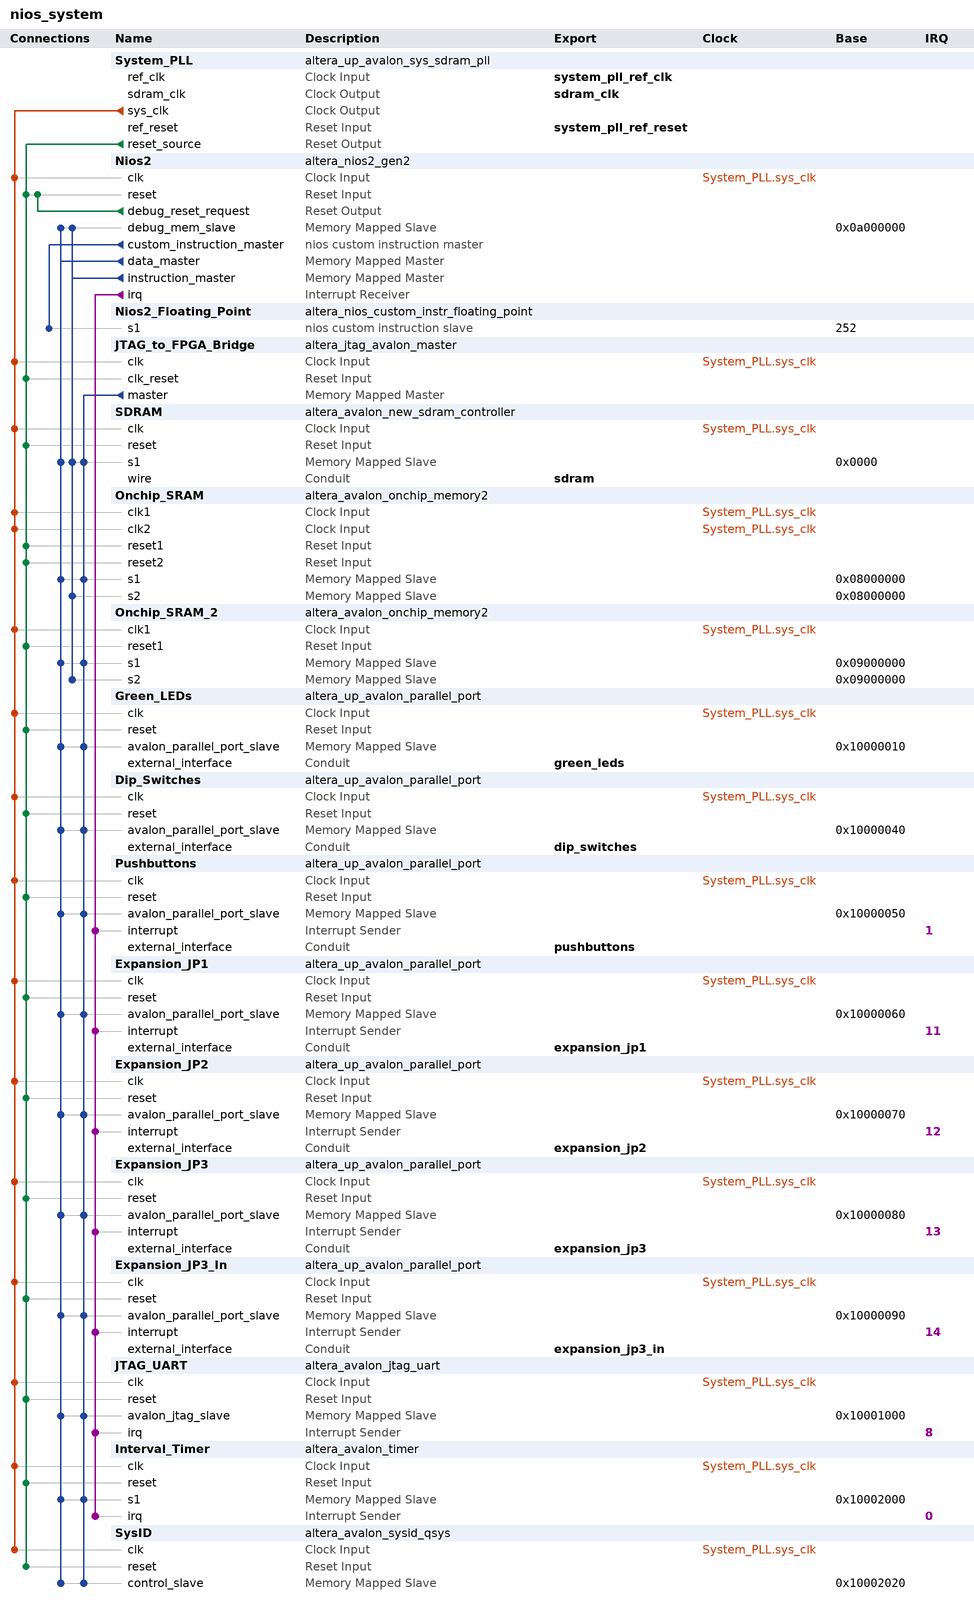
[diagram p0: system contents]
# Platform Designer (Qsys) system nios_system, Cyclone IV E EP4CE22F17C6
# Parameters at their usual value, and those the tool derives, are not listed.
package require -exact qsys 14.1
create_system nios_system
set_project_property DEVICE_FAMILY {Cyclone IV E}
set_project_property DEVICE EP4CE22F17C6

add_instance System_PLL altera_up_avalon_sys_sdram_pll 14.0
set_instance_parameter_value System_PLL CIV_boards DE0-Nano
set_instance_parameter_value System_PLL CV_boards DE1-SoC
set_instance_parameter_value System_PLL gui_outclk 50.0
set_instance_parameter_value System_PLL gui_refclk 50.0

add_instance Nios2 altera_nios2_gen2 14.1
set_instance_parameter_value Nios2 dcache_size 2048
set_instance_parameter_value Nios2 exceptionSlave Onchip_SRAM.s2
set_instance_parameter_value Nios2 icache_size 4096
set_instance_parameter_value Nios2 impl Tiny
set_instance_parameter_value Nios2 resetSlave Onchip_SRAM.s2
set_instance_parameter_value Nios2 resetrequest_enabled false
set_instance_parameter_value Nios2 setting_activateTrace true

add_instance Nios2_Floating_Point altera_nios_custom_instr_floating_point 14.1

add_instance JTAG_to_FPGA_Bridge altera_jtag_avalon_master 14.1

add_instance SDRAM altera_avalon_new_sdram_controller 14.1
set_instance_parameter_value SDRAM TAC 5.5
set_instance_parameter_value SDRAM TRCD 20.0
set_instance_parameter_value SDRAM TRP 20.0
set_instance_parameter_value SDRAM casLatency 3
set_instance_parameter_value SDRAM columnWidth 9
set_instance_parameter_value SDRAM dataWidth 16
set_instance_parameter_value SDRAM generateSimulationModel true
set_instance_parameter_value SDRAM model single_Micron_MT48LC4M32B2_7_chip
set_instance_parameter_value SDRAM numberOfBanks 4
set_instance_parameter_value SDRAM numberOfChipSelects 1
set_instance_parameter_value SDRAM powerUpDelay 100.0
set_instance_parameter_value SDRAM refreshPeriod 15.625
set_instance_parameter_value SDRAM rowWidth 13

add_instance Onchip_SRAM altera_avalon_onchip_memory2 14.1
set_instance_parameter_value Onchip_SRAM dataWidth 32
set_instance_parameter_value Onchip_SRAM dualPort true
set_instance_parameter_value Onchip_SRAM initMemContent true
set_instance_parameter_value Onchip_SRAM initializationFileName boot_code.hex
set_instance_parameter_value Onchip_SRAM memorySize 8192
set_instance_parameter_value Onchip_SRAM resetrequest_enabled false
set_instance_parameter_value Onchip_SRAM useNonDefaultInitFile true

add_instance Onchip_SRAM_2 altera_avalon_onchip_memory2 14.1
set_instance_parameter_value Onchip_SRAM_2 dataWidth 32
set_instance_parameter_value Onchip_SRAM_2 dualPort true
set_instance_parameter_value Onchip_SRAM_2 initMemContent true
set_instance_parameter_value Onchip_SRAM_2 initializationFileName onchip_mem.hex
set_instance_parameter_value Onchip_SRAM_2 memorySize 8192
set_instance_parameter_value Onchip_SRAM_2 resetrequest_enabled false
set_instance_parameter_value Onchip_SRAM_2 singleClockOperation true

add_instance Green_LEDs altera_up_avalon_parallel_port 14.0
set_instance_parameter_value Green_LEDs board DE0-Nano
set_instance_parameter_value Green_LEDs capture false
set_instance_parameter_value Green_LEDs edge Rising
set_instance_parameter_value Green_LEDs irq false
set_instance_parameter_value Green_LEDs preset LEDs

add_instance Dip_Switches altera_up_avalon_parallel_port 14.0
set_instance_parameter_value Dip_Switches board DE0-Nano
set_instance_parameter_value Dip_Switches capture false
set_instance_parameter_value Dip_Switches edge Rising
set_instance_parameter_value Dip_Switches irq false
set_instance_parameter_value Dip_Switches preset {Dip Switches}

add_instance Pushbuttons altera_up_avalon_parallel_port 14.0
set_instance_parameter_value Pushbuttons board DE0-Nano
set_instance_parameter_value Pushbuttons capture true
set_instance_parameter_value Pushbuttons edge Falling
set_instance_parameter_value Pushbuttons irq true
set_instance_parameter_value Pushbuttons preset Pushbuttons

add_instance Expansion_JP1 altera_up_avalon_parallel_port 14.0
set_instance_parameter_value Expansion_JP1 board DE0-Nano
set_instance_parameter_value Expansion_JP1 capture true
set_instance_parameter_value Expansion_JP1 edge Falling
set_instance_parameter_value Expansion_JP1 irq true
set_instance_parameter_value Expansion_JP1 preset {Expansion Header}

add_instance Expansion_JP2 altera_up_avalon_parallel_port 14.0
set_instance_parameter_value Expansion_JP2 board DE0-Nano
set_instance_parameter_value Expansion_JP2 capture true
set_instance_parameter_value Expansion_JP2 edge Falling
set_instance_parameter_value Expansion_JP2 gpio {GPIO 1 (JP2)}
set_instance_parameter_value Expansion_JP2 irq true
set_instance_parameter_value Expansion_JP2 preset {Expansion Header}

add_instance Expansion_JP3 altera_up_avalon_parallel_port 14.0
set_instance_parameter_value Expansion_JP3 board DE0-Nano
set_instance_parameter_value Expansion_JP3 capture true
set_instance_parameter_value Expansion_JP3 edge Falling
set_instance_parameter_value Expansion_JP3 gpio {GPIO 2 (JP3)}
set_instance_parameter_value Expansion_JP3 irq true
set_instance_parameter_value Expansion_JP3 preset {Expansion Header}

add_instance Expansion_JP3_In altera_up_avalon_parallel_port 14.0
set_instance_parameter_value Expansion_JP3_In board DE0-Nano
set_instance_parameter_value Expansion_JP3_In capture true
set_instance_parameter_value Expansion_JP3_In edge Rising
set_instance_parameter_value Expansion_JP3_In gpio {GPIO 2 IN (JP3)}
set_instance_parameter_value Expansion_JP3_In irq true
set_instance_parameter_value Expansion_JP3_In preset {Expansion Header}

add_instance JTAG_UART altera_avalon_jtag_uart 14.1
set_instance_parameter_value JTAG_UART simInteractiveOptions NO_INTERACTIVE_WINDOWS

add_instance Interval_Timer altera_avalon_timer 14.1
set_instance_parameter_value Interval_Timer period 125.0
set_instance_parameter_value Interval_Timer periodUnits MSEC

add_instance SysID altera_avalon_sysid_qsys 14.1
set_instance_parameter_value SysID id 0

# connections
add_connection System_PLL.sys_clk Dip_Switches.clk clock
add_connection System_PLL.sys_clk Expansion_JP1.clk clock
add_connection System_PLL.sys_clk Expansion_JP2.clk clock
add_connection System_PLL.sys_clk Expansion_JP3.clk clock
add_connection System_PLL.sys_clk Expansion_JP3_In.clk clock
add_connection System_PLL.sys_clk Green_LEDs.clk clock
add_connection System_PLL.sys_clk Interval_Timer.clk clock
add_connection System_PLL.sys_clk JTAG_to_FPGA_Bridge.clk clock
add_connection System_PLL.sys_clk JTAG_UART.clk clock
add_connection System_PLL.sys_clk Nios2.clk clock
add_connection System_PLL.sys_clk Onchip_SRAM.clk1 clock
add_connection System_PLL.sys_clk Onchip_SRAM.clk2 clock
add_connection System_PLL.sys_clk Onchip_SRAM_2.clk1 clock
add_connection System_PLL.sys_clk Pushbuttons.clk clock
add_connection System_PLL.sys_clk SDRAM.clk clock
add_connection System_PLL.sys_clk SysID.clk clock
add_connection Nios2.debug_reset_request Nios2.reset reset
add_connection System_PLL.reset_source Dip_Switches.reset reset
add_connection System_PLL.reset_source Expansion_JP1.reset reset
add_connection System_PLL.reset_source Expansion_JP2.reset reset
add_connection System_PLL.reset_source Expansion_JP3.reset reset
add_connection System_PLL.reset_source Expansion_JP3_In.reset reset
add_connection System_PLL.reset_source Green_LEDs.reset reset
add_connection System_PLL.reset_source Interval_Timer.reset reset
add_connection System_PLL.reset_source JTAG_to_FPGA_Bridge.clk_reset reset
add_connection System_PLL.reset_source JTAG_UART.reset reset
add_connection System_PLL.reset_source Nios2.reset reset
add_connection System_PLL.reset_source Onchip_SRAM.reset1 reset
add_connection System_PLL.reset_source Onchip_SRAM.reset2 reset
add_connection System_PLL.reset_source Onchip_SRAM_2.reset1 reset
add_connection System_PLL.reset_source Pushbuttons.reset reset
add_connection System_PLL.reset_source SDRAM.reset reset
add_connection System_PLL.reset_source SysID.reset reset
add_connection JTAG_to_FPGA_Bridge.master Dip_Switches.avalon_parallel_port_slave avalon
set_connection_parameter_value JTAG_to_FPGA_Bridge.master/Dip_Switches.avalon_parallel_port_slave baseAddress 0x10000040
add_connection JTAG_to_FPGA_Bridge.master Expansion_JP1.avalon_parallel_port_slave avalon
set_connection_parameter_value JTAG_to_FPGA_Bridge.master/Expansion_JP1.avalon_parallel_port_slave baseAddress 0x10000060
add_connection JTAG_to_FPGA_Bridge.master Expansion_JP2.avalon_parallel_port_slave avalon
set_connection_parameter_value JTAG_to_FPGA_Bridge.master/Expansion_JP2.avalon_parallel_port_slave baseAddress 0x10000070
add_connection JTAG_to_FPGA_Bridge.master Expansion_JP3.avalon_parallel_port_slave avalon
set_connection_parameter_value JTAG_to_FPGA_Bridge.master/Expansion_JP3.avalon_parallel_port_slave baseAddress 0x10000080
add_connection JTAG_to_FPGA_Bridge.master Expansion_JP3_In.avalon_parallel_port_slave avalon
set_connection_parameter_value JTAG_to_FPGA_Bridge.master/Expansion_JP3_In.avalon_parallel_port_slave baseAddress 0x10000090
add_connection JTAG_to_FPGA_Bridge.master Green_LEDs.avalon_parallel_port_slave avalon
set_connection_parameter_value JTAG_to_FPGA_Bridge.master/Green_LEDs.avalon_parallel_port_slave baseAddress 0x10000010
add_connection JTAG_to_FPGA_Bridge.master Interval_Timer.s1 avalon
set_connection_parameter_value JTAG_to_FPGA_Bridge.master/Interval_Timer.s1 baseAddress 0x10002000
add_connection JTAG_to_FPGA_Bridge.master JTAG_UART.avalon_jtag_slave avalon
set_connection_parameter_value JTAG_to_FPGA_Bridge.master/JTAG_UART.avalon_jtag_slave baseAddress 0x10001000
add_connection JTAG_to_FPGA_Bridge.master Onchip_SRAM.s1 avalon
set_connection_parameter_value JTAG_to_FPGA_Bridge.master/Onchip_SRAM.s1 baseAddress 0x08000000
add_connection JTAG_to_FPGA_Bridge.master Onchip_SRAM_2.s1 avalon
set_connection_parameter_value JTAG_to_FPGA_Bridge.master/Onchip_SRAM_2.s1 baseAddress 0x09000000
add_connection JTAG_to_FPGA_Bridge.master Pushbuttons.avalon_parallel_port_slave avalon
set_connection_parameter_value JTAG_to_FPGA_Bridge.master/Pushbuttons.avalon_parallel_port_slave baseAddress 0x10000050
add_connection JTAG_to_FPGA_Bridge.master SDRAM.s1 avalon
set_connection_parameter_value JTAG_to_FPGA_Bridge.master/SDRAM.s1 baseAddress 0x0000
add_connection JTAG_to_FPGA_Bridge.master SysID.control_slave avalon
set_connection_parameter_value JTAG_to_FPGA_Bridge.master/SysID.control_slave baseAddress 0x10002020
add_connection Nios2.data_master Dip_Switches.avalon_parallel_port_slave avalon
set_connection_parameter_value Nios2.data_master/Dip_Switches.avalon_parallel_port_slave baseAddress 0x10000040
add_connection Nios2.data_master Expansion_JP1.avalon_parallel_port_slave avalon
set_connection_parameter_value Nios2.data_master/Expansion_JP1.avalon_parallel_port_slave baseAddress 0x10000060
add_connection Nios2.data_master Expansion_JP2.avalon_parallel_port_slave avalon
set_connection_parameter_value Nios2.data_master/Expansion_JP2.avalon_parallel_port_slave baseAddress 0x10000070
add_connection Nios2.data_master Expansion_JP3.avalon_parallel_port_slave avalon
set_connection_parameter_value Nios2.data_master/Expansion_JP3.avalon_parallel_port_slave baseAddress 0x10000080
add_connection Nios2.data_master Expansion_JP3_In.avalon_parallel_port_slave avalon
set_connection_parameter_value Nios2.data_master/Expansion_JP3_In.avalon_parallel_port_slave baseAddress 0x10000090
add_connection Nios2.data_master Green_LEDs.avalon_parallel_port_slave avalon
set_connection_parameter_value Nios2.data_master/Green_LEDs.avalon_parallel_port_slave baseAddress 0x10000010
add_connection Nios2.data_master Interval_Timer.s1 avalon
set_connection_parameter_value Nios2.data_master/Interval_Timer.s1 baseAddress 0x10002000
add_connection Nios2.data_master JTAG_UART.avalon_jtag_slave avalon
set_connection_parameter_value Nios2.data_master/JTAG_UART.avalon_jtag_slave baseAddress 0x10001000
add_connection Nios2.data_master Nios2.debug_mem_slave avalon
set_connection_parameter_value Nios2.data_master/Nios2.debug_mem_slave baseAddress 0x0a000000
add_connection Nios2.data_master Onchip_SRAM.s1 avalon
set_connection_parameter_value Nios2.data_master/Onchip_SRAM.s1 baseAddress 0x08000000
add_connection Nios2.data_master Onchip_SRAM_2.s1 avalon
set_connection_parameter_value Nios2.data_master/Onchip_SRAM_2.s1 baseAddress 0x09000000
add_connection Nios2.data_master Pushbuttons.avalon_parallel_port_slave avalon
set_connection_parameter_value Nios2.data_master/Pushbuttons.avalon_parallel_port_slave baseAddress 0x10000050
add_connection Nios2.data_master SDRAM.s1 avalon
set_connection_parameter_value Nios2.data_master/SDRAM.s1 baseAddress 0x0000
add_connection Nios2.data_master SysID.control_slave avalon
set_connection_parameter_value Nios2.data_master/SysID.control_slave baseAddress 0x10002020
add_connection Nios2.instruction_master Nios2.debug_mem_slave avalon
set_connection_parameter_value Nios2.instruction_master/Nios2.debug_mem_slave baseAddress 0x0a000000
add_connection Nios2.instruction_master Onchip_SRAM.s2 avalon
set_connection_parameter_value Nios2.instruction_master/Onchip_SRAM.s2 baseAddress 0x08000000
add_connection Nios2.instruction_master Onchip_SRAM_2.s2 avalon
set_connection_parameter_value Nios2.instruction_master/Onchip_SRAM_2.s2 baseAddress 0x09000000
add_connection Nios2.instruction_master SDRAM.s1 avalon
set_connection_parameter_value Nios2.instruction_master/SDRAM.s1 baseAddress 0x0000
add_connection Nios2.irq Expansion_JP1.interrupt interrupt
set_connection_parameter_value Nios2.irq/Expansion_JP1.interrupt irqNumber 11
add_connection Nios2.irq Expansion_JP2.interrupt interrupt
set_connection_parameter_value Nios2.irq/Expansion_JP2.interrupt irqNumber 12
add_connection Nios2.irq Expansion_JP3.interrupt interrupt
set_connection_parameter_value Nios2.irq/Expansion_JP3.interrupt irqNumber 13
add_connection Nios2.irq Expansion_JP3_In.interrupt interrupt
set_connection_parameter_value Nios2.irq/Expansion_JP3_In.interrupt irqNumber 14
add_connection Nios2.irq Interval_Timer.irq interrupt
set_connection_parameter_value Nios2.irq/Interval_Timer.irq irqNumber 0
add_connection Nios2.irq JTAG_UART.irq interrupt
set_connection_parameter_value Nios2.irq/JTAG_UART.irq irqNumber 8
add_connection Nios2.irq Pushbuttons.interrupt interrupt
set_connection_parameter_value Nios2.irq/Pushbuttons.interrupt irqNumber 1
add_connection Nios2.custom_instruction_master Nios2_Floating_Point.s1 nios_custom_instruction
set_connection_parameter_value Nios2.custom_instruction_master/Nios2_Floating_Point.s1 CIName nios2_floating_point
set_connection_parameter_value Nios2.custom_instruction_master/Nios2_Floating_Point.s1 baseAddress 252

# exported interfaces
add_interface dip_switches conduit end
set_interface_property dip_switches EXPORT_OF Dip_Switches.external_interface
add_interface expansion_jp1 conduit end
set_interface_property expansion_jp1 EXPORT_OF Expansion_JP1.external_interface
add_interface expansion_jp2 conduit end
set_interface_property expansion_jp2 EXPORT_OF Expansion_JP2.external_interface
add_interface expansion_jp3 conduit end
set_interface_property expansion_jp3 EXPORT_OF Expansion_JP3.external_interface
add_interface expansion_jp3_in conduit end
set_interface_property expansion_jp3_in EXPORT_OF Expansion_JP3_In.external_interface
add_interface green_leds conduit end
set_interface_property green_leds EXPORT_OF Green_LEDs.external_interface
add_interface pushbuttons conduit end
set_interface_property pushbuttons EXPORT_OF Pushbuttons.external_interface
add_interface sdram conduit end
set_interface_property sdram EXPORT_OF SDRAM.wire
add_interface sdram_clk clock source
set_interface_property sdram_clk EXPORT_OF System_PLL.sdram_clk
add_interface system_pll_ref_clk clock sink
set_interface_property system_pll_ref_clk EXPORT_OF System_PLL.ref_clk
add_interface system_pll_ref_reset reset sink
set_interface_property system_pll_ref_reset EXPORT_OF System_PLL.ref_reset

set_interconnect_requirement {$system} qsys_mm.clockCrossingAdapter HANDSHAKE
set_interconnect_requirement {$system} qsys_mm.insertDefaultSlave FALSE
set_interconnect_requirement {$system} qsys_mm.maxAdditionalLatency 1

save_system nios_system.qsys
